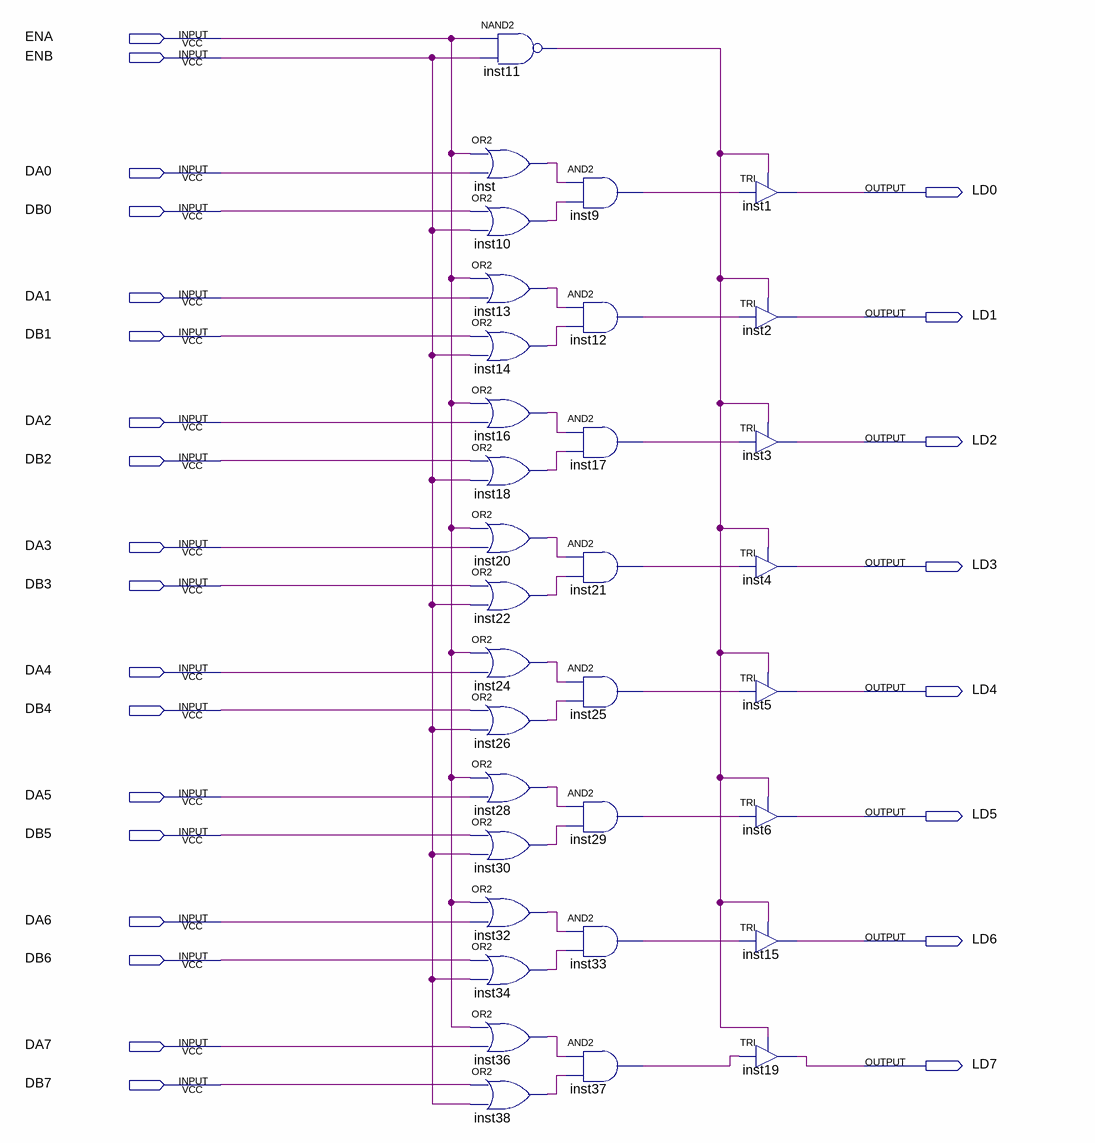
[diagram p0: schematic sheet]
// Quartus schematic 16bufer8_.bdf as structural Verilog: 33 symbols, 26 pins
module \16bufer8_  (
  input  ENA,
  input  ENB,
  input  DA0,
  input  DB0,
  input  DA1,
  input  DB1,
  input  DA2,
  input  DB2,
  input  DA3,
  input  DB3,
  input  DA4,
  input  DB4,
  input  DA5,
  input  DB5,
  input  DA6,
  input  DB6,
  input  DA7,
  input  DB7,
  output LD0,
  output LD1,
  output LD2,
  output LD3,
  output LD4,
  output LD5,
  output LD6,
  output LD7
);

  wire inst9_out, inst10_out, inst11_out, inst12_out, inst13_out, inst14_out, inst16_out, inst17_out,
       inst18_out, inst20_out, inst21_out, inst22_out, inst24_out, inst25_out, inst26_out, inst28_out,
       inst29_out, inst30_out, inst32_out, inst33_out, inst34_out, inst36_out, inst37_out, inst38_out,
       inst_out;

  or inst (inst_out, ENA, DA0);
  or inst10 (inst10_out, DB0, ENB);
  or inst13 (inst13_out, ENA, DA1);
  or inst14 (inst14_out, DB1, ENB);
  or inst16 (inst16_out, ENA, DA2);
  or inst18 (inst18_out, DB2, ENB);
  or inst20 (inst20_out, ENA, DA3);
  or inst22 (inst22_out, DB3, ENB);
  or inst24 (inst24_out, ENA, DA4);
  or inst26 (inst26_out, DB4, ENB);
  or inst28 (inst28_out, ENA, DA5);
  or inst30 (inst30_out, DB5, ENB);
  or inst32 (inst32_out, ENA, DA6);
  or inst34 (inst34_out, DB6, ENB);
  or inst36 (inst36_out, ENA, DA7);
  or inst38 (inst38_out, DB7, ENB);
  nand inst11 (inst11_out, ENA, ENB);
  and inst9 (inst9_out, inst_out, inst10_out);
  and inst12 (inst12_out, inst13_out, inst14_out);
  and inst17 (inst17_out, inst16_out, inst18_out);
  and inst21 (inst21_out, inst20_out, inst22_out);
  and inst25 (inst25_out, inst24_out, inst26_out);
  and inst29 (inst29_out, inst28_out, inst30_out);
  and inst33 (inst33_out, inst32_out, inst34_out);
  and inst37 (inst37_out, inst36_out, inst38_out);
  TRI inst1 (.IN(inst9_out), .OE(inst11_out), .OUT(LD0));
  TRI inst2 (.IN(inst12_out), .OE(inst11_out), .OUT(LD1));
  TRI inst3 (.IN(inst17_out), .OE(inst11_out), .OUT(LD2));
  TRI inst4 (.IN(inst21_out), .OE(inst11_out), .OUT(LD3));
  TRI inst5 (.IN(inst25_out), .OE(inst11_out), .OUT(LD4));
  TRI inst6 (.IN(inst29_out), .OE(inst11_out), .OUT(LD5));
  TRI inst15 (.IN(inst33_out), .OE(inst11_out), .OUT(LD6));
  TRI inst19 (.IN(inst37_out), .OE(inst11_out), .OUT(LD7));
endmodule
